# Altium schematic sheet 4WD_V1.0.SchDoc
size A3
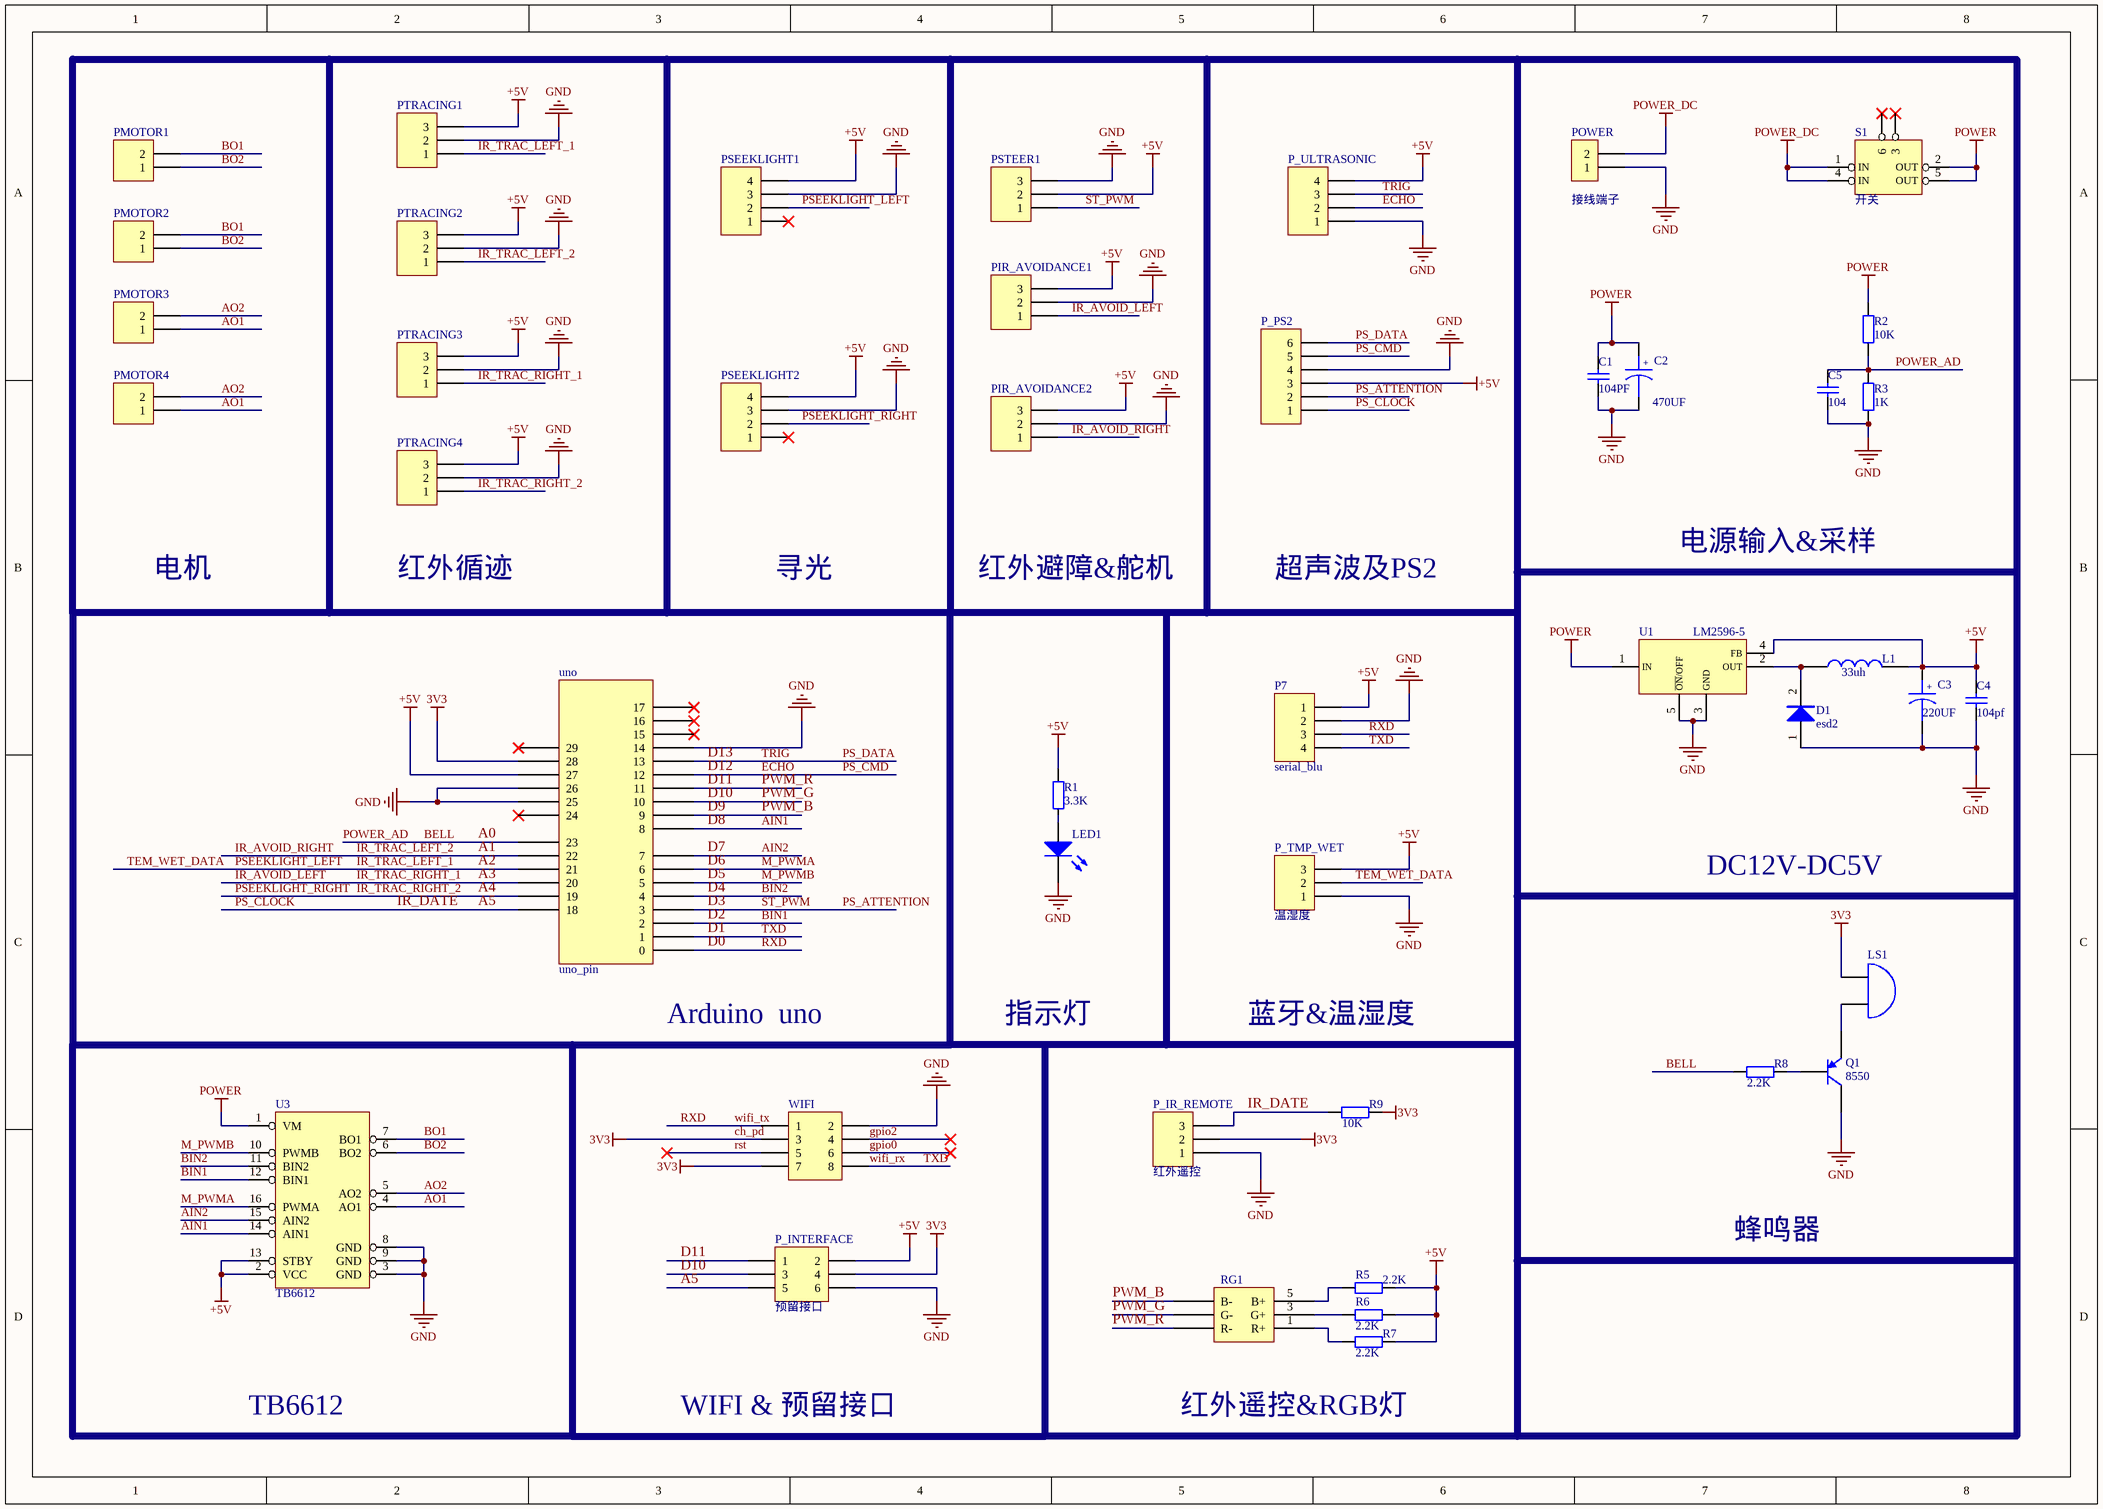
[diagram p0: 4WD_V1.0.SchDoc]

## Parts
C1  Cap  [C 0603_L]  (value not drawn)
C2  CAP4 电解电容  [CAP6.3]  (value not drawn)
C3  CAP4 电解电容  [CAP6.3]  (value not drawn)
C4  Cap  [C 0603_L]  (value not drawn)
C5  value 104  [C 0603_L]  (hidden comment: Cap)
D1  esd2  [SMA]
L1  INDUCTOR 0  [CDRH74]  (value not drawn)
LED1  LED3  [LED 0603Y]  (value not drawn)
LS1  Bell  [BEEP 5x9x5.5]  (value not drawn)
P7  serial_blu  [HDR2.54-M-LI-4P]
P_INTERFACE  预留接口  [HDR2.54-LI-2x3P]
P_IR_REMOTE  红外遥控  [HDR2.54-M-LI-3P]
P_PS2  Header 6  [HDR2.54-LI-6P]  (value not drawn)
P_TMP_WET  温湿度  [HDR2.54-M-LI-3P]
P_ULTRASONIC  Header 4  [HDR2.54-WI-4P]  (value not drawn)
PIR_AVOIDANCE1  Header 3  [XH2.54-WI-3P]  (value not drawn)
PIR_AVOIDANCE2  Header 3  [XH2.54-WI-3P]  (value not drawn)
PMOTOR1  Header 2  [XH2.54-WI-2P]  (value not drawn)
PMOTOR2  Header 2  [XH2.54-WI-2P]  (value not drawn)
PMOTOR3  Header 2  [XH2.54-WI-2P]  (value not drawn)
PMOTOR4  Header 2  [XH2.54-WI-2P]  (value not drawn)
POWER  接线端子  [XH2.54-WI-2P]
PSEEKLIGHT1  Header 4  [XH2.54-WI-4P]  (value not drawn)
PSEEKLIGHT2  Header 4  [XH2.54-WI-4P]  (value not drawn)
PSTEER1  Header 3  [HDR2.54-WI-3P]  (value not drawn)
PTRACING1  Header 3  [XH2.54-WI-3P]  (value not drawn)
PTRACING2  Header 3  [XH2.54-WI-3P]  (value not drawn)
PTRACING3  Header 3  [XH2.54-WI-3P]  (value not drawn)
PTRACING4  Header 3  [XH2.54-WI-3P]  (value not drawn)
Q1  8550  [SOT23-3L]
R1  value 3.3K  [R 0603_L]  (hidden comment: Res2)
R2  value 10K  [R 0603_L]  (hidden comment: Res2)
R3  value 1K  [R 0603_L]  (hidden comment: Res2)
R5  value 2.2K  [R 0603_L]  (hidden comment: Res2)
R6  value 2.2K  [R 0603_L]  (hidden comment: Res2)
R7  value 2.2K  [R 0603_L]  (hidden comment: Res2)
R8  value 2.2K  [R 0603_L]  (hidden comment: Res2)
R9  value 10K  [R 0603_L]  (hidden comment: Res2)
RG1  RGB_LED_6  [LED 5050]  (value not drawn)
S1  开关  [SWITCH_SELFLOCKING]
U1  LM2596-5  [TO263-5A]
U3  TB6612  [TB6612]
uno  uno_pin  [UNO_PIN]
WIFI  Header 4X2  [wifi]  (value not drawn)

## Nets
+5V: C3.1 C4.2 L1.2 P7.1 P_INTERFACE.2 P_PS2.3 P_TMP_WET.3 P_ULTRASONIC.4 PIR_AVOIDANCE1.3 PIR_AVOIDANCE2.3 PSEEKLIGHT1.4 PSEEKLIGHT2.4 PSTEER1.2 PTRACING1.3 PTRACING2.3 PTRACING3.3 PTRACING4.3 R1.1 R5.1 R6.1 R7.1 U1.4(FB) U3.2(VCC) U3.13(STBY) uno.27
ch_pd: LS1.1(A) P_INTERFACE.4 P_IR_REMOTE.2 R9.1 uno.28 WIFI.3 WIFI.7  [also labelled 3V3]
GND: C1.1 C2.2 C3.2 C4.1 C5.2 D1.1 LED1.2(K) P7.2 P_INTERFACE.6 P_IR_REMOTE.1 P_PS2.4 P_TMP_WET.1 P_ULTRASONIC.1 PIR_AVOIDANCE1.2 PIR_AVOIDANCE2.2 POWER.1 PSEEKLIGHT1.3 PSEEKLIGHT2.3 PSTEER1.3 PTRACING1.2 PTRACING2.2 PTRACING3.2 PTRACING4.2 Q1.3(C) R3.2 U1.3(GND) U1.5(~{ON}/OFF) U3.3(GND) U3.8(GND) U3.9(GND) uno.14 uno.25 uno.26 WIFI.2
POWER: C1.2 C2.1 R2.1 S1.2(OUT) S1.5(OUT) U1.1(IN) U3.1(VM)
POWER_DC: POWER.2 S1.1(IN) S1.4(IN)
A0: C5.1 R2.2 R3.1 R8.2 uno.23  [also labelled BELL, POWER_AD]
A1: PIR_AVOIDANCE2.1 PTRACING2.1 uno.22  [also labelled IR_AVOID_RIGHT, IR_TRAC_LEFT_2]
A2: P_TMP_WET.2 PSEEKLIGHT1.2 PTRACING1.1 uno.21  [also labelled IR_TRAC_LEFT_1, PSEEKLIGHT_LEFT, TEM_WET_DATA]
A3: PIR_AVOIDANCE1.1 PTRACING3.1 uno.20  [also labelled IR_AVOID_LEFT, IR_TRAC_RIGHT_1]
A4: PSEEKLIGHT2.2 PTRACING4.1 uno.19  [also labelled IR_TRAC_RIGHT_2, PSEEKLIGHT_RIGHT]
A5: P_INTERFACE.5 P_IR_REMOTE.3 P_PS2.1 R9.2 uno.18  [also labelled IR_DATE, PS_CLOCK]
AIN1: U3.14(AIN1) uno.8  [also labelled D8]
AIN2: U3.15(AIN2) uno.7  [also labelled D7]
AO1: PMOTOR3.1 PMOTOR4.1 U3.4(AO1)
AO2: PMOTOR3.2 PMOTOR4.2 U3.5(AO2)
BIN1: U3.12(BIN1) uno.2  [also labelled D2]
BIN2: U3.11(BIN2) uno.4  [also labelled D4]
BO1: PMOTOR1.2 PMOTOR2.2 U3.7(BO1)
BO2: PMOTOR1.1 PMOTOR2.1 U3.6(BO2)
D0: P7.3 uno.0 WIFI.1  [also labelled RXD, wifi_tx]
D1: P7.4 uno.1 WIFI.8  [also labelled TXD, wifi_rx]
D3: P_PS2.2 PSTEER1.1 uno.3  [also labelled PS_ATTENTION, ST_PWM]
D5: U3.10(PWMB) uno.5  [also labelled M_PWMB]
D6: U3.16(PWMA) uno.6  [also labelled M_PWMA]
D9: RG1.6(B-) uno.9  [also labelled PWM_B]
D10: P_INTERFACE.3 RG1.4(G-) uno.10  [also labelled PWM_G]
D11: P_INTERFACE.1 RG1.2(R-) uno.11  [also labelled PWM_R]
D12: P_PS2.5 P_ULTRASONIC.2 uno.12  [also labelled ECHO, PS_CMD]
D13: P_PS2.6 P_ULTRASONIC.3 uno.13  [also labelled PS_DATA, TRIG]
gpio0: WIFI.6
gpio2: WIFI.4
rst: WIFI.5
NetD1_2: D1.2 L1.1 U1.2(OUT)
NetLED1_1: LED1.1(A) R1.2
NetLS1_2: LS1.2(B) Q1.2(E)
NetQ1_1: Q1.1(B) R8.1
NetR5_2: R5.2 RG1.5(B+)
NetR6_2: R6.2 RG1.3(G+)
NetR7_2: R7.2 RG1.1(R+)

Not connected (* = marked no-connect by the designer): PSEEKLIGHT1 1*; PSEEKLIGHT2 1*; S1 3* 6*; uno 15* 16* 17* 24* 29*

## Notes on the sheet
- 电机
- 红外循迹
- 寻光
- 红外避障&舵机
- 超声波及PS2
- 电源输入&采样
- DC12V-DC5V
- (near uno) Arduino  uno
- 指示灯
- 蓝牙&温湿度
- 蜂鸣器
- TB6612
- WIFI & 预留接口
- 红外遥控&RGB灯
- (in symbol Cap) 104PF; 104pf
- (in symbol CAP4 电解电容) +; 470UF; 220UF
- (in symbol INDUCTOR 0) 33uh

## Library data of the parts
C1 C4 C5 = Cap: Capacitor; Published: 8-Jun-2000; LatestRevisionDate: 17-Jul-2002; LatestRevisionNote: Re-released for DXP Platform.; PackageReference: RAD-0.3; Publisher: Altium Limited
C2 C3 = CAP4 电解电容: Capacitor
D1 = DIODE2
LED1 = LED2: Typical RED, GREEN, YELLOW, AMBER GaAs LED; Published: 8-Jun-2000; LatestRevisionDate: 17-Jul-2002; LatestRevisionNote: Re-released for DXP Platform.; PackageVersion: Feb-2002; PackageReference: 3.2X1.6X1.1; Publisher: Altium Limited; PackageDescription: SM LED; 2 Flat Leads
LS1 = Bell: Electrical Bell; Published: 24-Mar-1999; LatestRevisionDate: 17-Jul-2002; LatestRevisionNote: Re-released for DXP Platform.; PackageReference: PIN2; Publisher: Altium Limited
P7 P_ULTRASONIC PSEEKLIGHT1 PSEEKLIGHT2 = Header 4: Header, 4-Pin; LatestRevisionDate: 17-Jul-2002; LatestRevisionNote: Re-released for DXP Platform.; Publisher: Altium Limited
P_INTERFACE = Header 3X2: Header, 3-Pin, Dual row; LatestRevisionDate: 17-Jul-2002; LatestRevisionNote: Re-released for DXP Platform.; Publisher: Altium Limited
P_IR_REMOTE P_TMP_WET PIR_AVOIDANCE1 PIR_AVOIDANCE2 PSTEER1 PTRACING1-PTRACING4 = Header 3: Header, 3-Pin; LatestRevisionDate: 17-Jul-2002; LatestRevisionNote: Re-released for DXP Platform.; Publisher: Altium Limited
P_PS2 = Header 6: Header, 6-Pin; LatestRevisionDate: 17-Jul-2002; LatestRevisionNote: Re-released for DXP Platform.; Publisher: Altium Limited
PMOTOR1-PMOTOR4 = Header 2: Header, 2-Pin; LatestRevisionDate: 17-Jul-2002; LatestRevisionNote: Re-released for DXP Platform.; Publisher: Altium Limited
POWER = PIN2
Q1 = 2N3906: PNP General Purpose Amplifier; Published: 8-Jun-2000; LatestRevisionDate: 15-Jan-2003; LatestRevisionNote: PCB Footprint 'BCY-W3/D4.7' replaced; DatasheetVersion: 1997; PackageVersion: Sep-1998; PackageReference: TO-92A; Publisher: Altium Limited; PackageDescription: TO, Flat Index; 3 In-Line, Axial Leads; Body Dia. 4.5mm; Leads 0.51 x 0.48 mm (max); ComponentLink1Description: Manufacturer Link; ComponentLink1URL: http://www.fairchildsemi.com/; ComponentLink2Description: Datasheet; ComponentLink2URL: http://www.fairchildsemi.com/ds/2N%2F2N3906.pdf
R1-R3 R5-R9 = Res2: Resistor; Published: 8-Jun-2000; LatestRevisionDate: 17-Jul-2002; LatestRevisionNote: Re-released for DXP Platform.; PackageReference: AXIAL-0.4; Publisher: Altium Limited
  R1 R5-R9: PackageDescription: Axial Device, Thru-Hole; 2 Leads; 0.4 in Pin Spacing
S1 = switch
U1 = LM2560-5
WIFI = Header 4X2: Header, 4-Pin, Dual row; LatestRevisionDate: 17-Jul-2002; LatestRevisionNote: Re-released for DXP Platform.; Publisher: Altium Limited